# Altium schematic sheet NL_Sheet1.SchDoc
size A3
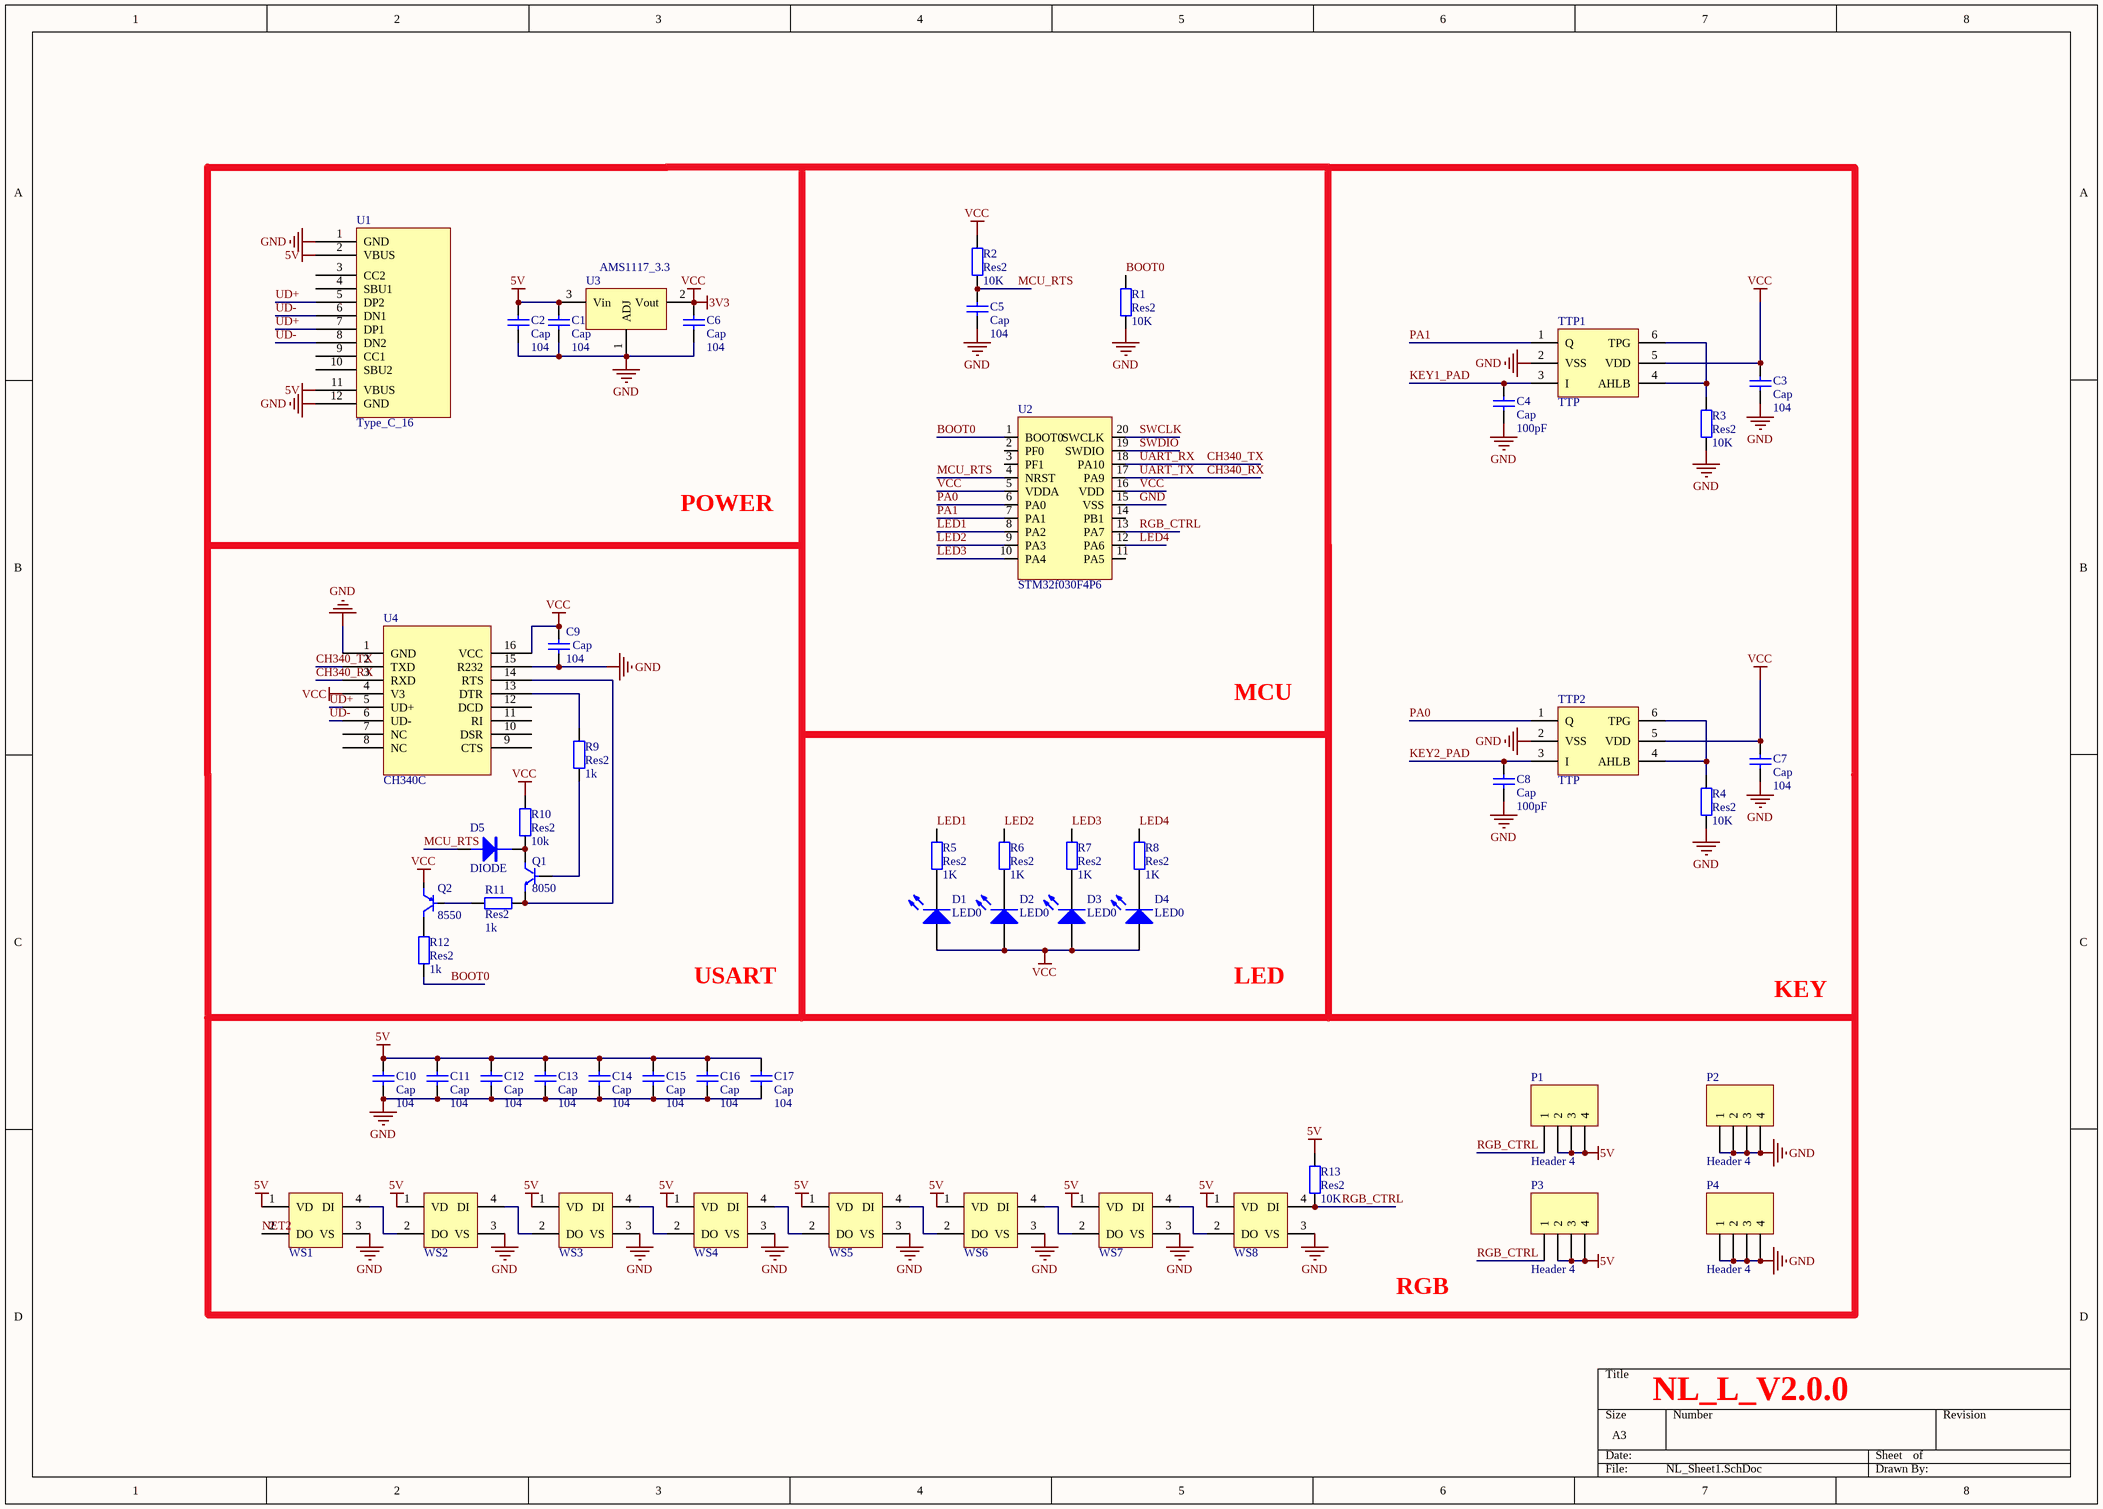
[diagram p0: NL_Sheet1.SchDoc]

## Parts
C1  Cap  value 104  [0805]
C2  Cap  value 104  [0805]
C3  Cap  value 104  [0805]
C4  Cap  value 100pF  [0805]
C5  Cap  value 104  [0805]
C6  Cap  value 104  [0805]
C7  Cap  value 104  [0805]
C8  Cap  value 100pF  [0805]
C9  Cap  value 104  [0805]
C10  Cap  value 104  [0805]
C11  Cap  value 104  [0805]
C12  Cap  value 104  [0805]
C13  Cap  value 104  [0805]
C14  Cap  value 104  [0805]
C15  Cap  value 104  [0805]
C16  Cap  value 104  [0805]
C17  Cap  value 104  [0805]
D1  LED0  [0805]
D2  LED0  [0805]
D3  LED0  [0805]
D4  LED0  [0805]
D5  DIODE  [0805L]
P1  Header 4  [HDR1X4]
P2  Header 4  [HDR1X4]
P3  Header 4  [HDR1X4]
P4  Header 4  [HDR1X4]
Q1  8050  [SOT23]
Q2  8550  [SOT23]
R1  Res2  value 10K  [0805]
R2  Res2  value 10K  [0805]
R3  Res2  value 10K  [0805]
R4  Res2  value 10K  [0805]
R5  Res2  value 1K  [0805]
R6  Res2  value 1K  [0805]
R7  Res2  value 1K  [0805]
R8  Res2  value 1K  [0805]
R9  Res2  value 1k  [0805]
R10  Res2  value 10k  [0805]
R11  Res2  value 1k  [0805]
R12  Res2  value 1k  [0805]
R13  Res2  value 10K  [0805]
TTP1  TTP  [SOT23-6L]
TTP2  TTP  [SOT23-6L]
U1  Type_C_16  [Type_C16]
U2  STM32f030F4P6  [SSOP20]
U3  AMS1117_3.3  [SOT-223]
U4  CH340C  [SOP16]
WS1  WS2812  [WS2812]  (value not drawn)
WS2  WS2812  [WS2812]  (value not drawn)
WS3  WS2812  [WS2812]  (value not drawn)
WS4  WS2812  [WS2812]  (value not drawn)
WS5  WS2812  [WS2812]  (value not drawn)
WS6  WS2812  [WS2812]  (value not drawn)
WS7  WS2812  [WS2812]  (value not drawn)
WS8  WS2812  [WS2812]  (value not drawn)

## Nets
5V: C1.2 C2.2 C10.2 C11.2 C12.2 C13.2 C14.2 C15.2 C16.2 C17.2 P1.2 P1.3 P1.4 P3.2 P3.3 P3.4 R13.2 U1.2(VBUS) U1.11(VBUS) U3.3(Vin) WS1.1(VD) WS2.1(VD) WS3.1(VD) WS4.1(VD) WS5.1(VD) WS6.1(VD) WS7.1(VD) WS8.1(VD)
GND: C1.1 C2.1 C3.1 C4.1 C5.1 C6.1 C7.1 C8.1 C9.1 C10.1 C11.1 C12.1 C13.1 C14.1 C15.1 C16.1 C17.1 P2.1 P2.2 P2.3 P2.4 P4.1 P4.2 P4.3 P4.4 R1.1 R3.1 R4.1 TTP1.2(VSS) TTP2.2(VSS) U1.1(GND) U1.12(GND) U2.15(VSS) U3.1(ADJ) U4.1(GND) U4.15(R232) WS1.3(VS) WS2.3(VS) WS3.3(VS) WS4.3(VS) WS5.3(VS) WS6.3(VS) WS7.3(VS) WS8.3(VS)
VCC: C3.2 C6.2 C7.2 C9.2 D1.1(A) D2.1(A) D3.1(A) D4.1(A) Q2.e R2.2 R10.1 TTP1.5(VDD) TTP2.5(VDD) U2.5(VDDA) U2.16(VDD) U3.2(Vout) U4.4(V3) U4.16(VCC)  [also labelled 3V3]
BOOT0: R1.2 R12.1 U2.1(BOOT0)
CH340_RX: U2.17(PA9) U4.3(RXD)  [also labelled UART_TX]
CH340_TX: U2.18(PA10) U4.2(TXD)  [also labelled UART_RX]
KEY1_PAD: C4.2 TTP1.3(I)
KEY2_PAD: C8.2 TTP2.3(I)
LED1: R5.2 U2.8(PA2)
LED2: R6.2 U2.9(PA3)
LED3: R7.2 U2.10(PA4)
LED4: R8.2 U2.12(PA6)
MCU_RTS: C5.2 D5.1 R2.1 U2.4(NRST)
NET2: WS1.2(DO)
PA0: TTP2.1(Q) U2.6(PA0)
PA1: TTP1.1(Q) U2.7(PA1)
RGB_CTRL: P1.1 P3.1 R13.1 U2.13(PA7) WS8.4(DI)
SWCLK: U2.20(SWCLK)
SWDIO: U2.19(SWDIO)
UD+: U1.5(DP2) U1.7(DP1) U4.5(UD+)
UD-: U1.6(DN1) U1.8(DN2) U4.6(UD-)
NetD1_2: D1.2(K) R5.1
NetD2_2: D2.2(K) R6.1
NetD3_2: D3.2(K) R7.1
NetD4_2: D4.2(K) R8.1
NetD5_2: D5.2 Q1.c R10.2
NetQ1_b: Q1.b R9.2
NetQ1_e: Q1.e R11.2 U4.14(RTS)
NetQ2_b: Q2.b R11.1
NetQ2_c: Q2.c R12.2
NetR3_2: R3.2 TTP1.4(AHLB) TTP1.6(TPG)
NetR4_2: R4.2 TTP2.4(AHLB) TTP2.6(TPG)
NetR9_1: R9.1 U4.13(DTR)
NetWS1_4: WS1.4(DI) WS2.2(DO)
NetWS2_4: WS2.4(DI) WS3.2(DO)
NetWS3_4: WS3.4(DI) WS4.2(DO)
NetWS4_4: WS4.4(DI) WS5.2(DO)
NetWS5_4: WS5.4(DI) WS6.2(DO)
NetWS6_4: WS6.4(DI) WS7.2(DO)
NetWS7_4: WS7.4(DI) WS8.2(DO)

Not connected (* = marked no-connect by the designer): U1 3(CC2) 4(SBU1) 9(CC1) 10(SBU2); U2 2(PF0) 3(PF1) 11(PA5) 14(PB1); U4 7(NC) 8(NC) 9(CTS) 10(DSR) 11(RI) 12(DCD)

## Notes on the sheet
- POWER
- MCU
- USART
- LED
- KEY
- RGB
- NL_L_V2.0.0

## Library data of the parts
C1-C17 = Cap: Capacitor; Published: 8-Jun-2000; LatestRevisionDate: 17-Jul-2002; LatestRevisionNote: Re-released for DXP Platform.; PackageReference: RAD-0.3; Publisher: Altium Limited; PackageDescription: Radial Cap, Thru-Hole; 2 Leads; 0.3 in Pin Spacing
D1-D4 = LED0: Typical INFRARED GaAs LED; Published: 8-Jun-2000; LatestRevisionDate: 08-Jul-2005; LatestRevisionNote: Mech Layer 1 removed.; PackageReference: LED-0; Publisher: Altium Limited; PackageDescription: LED; 2 Leads
P1-P4 = Header 4: Header, 4-Pin; LatestRevisionDate: 17-Jul-2002; LatestRevisionNote: Re-released for DXP Platform.; Publisher: Altium Limited
Q1 = NPN
Q2 = PNP
R1-R13 = Res2: Resistor; Published: 8-Jun-2000; LatestRevisionDate: 17-Jul-2002; LatestRevisionNote: Re-released for DXP Platform.; PackageReference: AXIAL-0.4; Publisher: Altium Limited; PackageDescription: Axial Device, Thru-Hole; 2 Leads; 0.4 in Pin Spacing
TTP1 TTP2 = TTP223
U3 = LM317: 3-Terminal Adjustable Positive Voltage Regulator